# EAGLE design Ctrl_Enc20 (EAGLE 9.1.2)
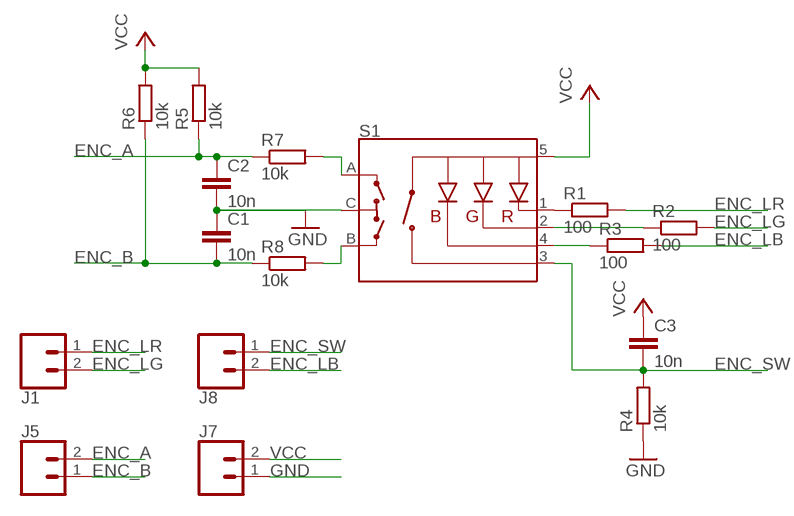
[diagram p0: schematic, sheet 1]

## Parts
C1  10n  C-EUC0603  [C0603]
C2  10n  C-EUC0603  [C0603]
C3  10n  C-EUC0603  [C0603]
J1  CONN_02  [1X02]
J5  CONN_02  [1X02]
J7  CONN_02  [1X02]
J8  CONN_02  [1X02]
R1  100  R-EU_R0603  [R0603]
R2  100  R-EU_R0603  [R0603]
R3  100  R-EU_R0603  [R0603]
R4  10k  R-EU_R0603  [R0603]
R5  10k  R-EU_R0603  [R0603]
R6  10k  R-EU_R0603  [R0603]
R7  10k  R-EU_R0603  [R0603]
R8  10k  R-EU_R0603  [R0603]
S1  ENCODER-RGB-SWITCH  [ENCODER_LED_3]

## Nets
ENC_A: C2.1 J5.2 R5.1 R7.1
ENC_B: C1.2 J5.1 R6.1 R8.1
ENC_LB: J8.2 R3.2
ENC_LG: J1.2 R2.2
ENC_LR: J1.1 R1.2
ENC_SW: C3.2 J8.1 R4.2 S1.3(SW)
GND: C1.1 C2.2 J7.1 R4.1 S1.C
N$1: R1.1 S1.1(-R)
N$2: R2.1 S1.2(-G)
N$3: R3.1 S1.4(-B)
N$4: R7.2 S1.A
N$5: R8.2 S1.B
VCC: C3.1 J7.2 R5.2 R6.2 S1.5(+)

## Library data of the parts
C1-C3 = rcl:C-EU: CAPACITOR, European symbol; SPICEPREFIX: C
J1 J5 J7 J8 = SparkFun-Connectors:CONN_02: Multi connection point. Often used as Generic Header-pin footprint for 0.1 inch spaced/style header connections On any of the 0.1 inch spaced packages, you can populate with these: Break Away Headers - Straight <https://www.sparkfun.com/products/116> (PRT-00116) Break Away Male Headers - Right Angle <https://www.sparkfun.com/products/553> (PRT-00553) Female Headers <https://www.sparkfun.com/products/115> (PRT-00115) Break Away Headers - Machine Pin <https://www.sparkfun.com/products/117> (PRT-00117) Break Away Female Headers - Swiss Machine Pin <https://www.sparkfun.com/products/743> (PRT-00743) For SCREWTERMINALS and SPRING TERMINALS visit here: Screw Terimnals on SparkFun.com <https://www.sparkfun.com/search/results?term=Screw+Terminals> (5mm/3.5mm/2.54mm spacing) This device is also useful as a general connection point to wire up your design to another part of your project. Our various solder wires solder well into these plated through hole pads. Hook-Up Wire - Assortment (Stranded, 22 AWG) <https://www.sparkfun.com/products/11375> (PRT-11375) Hook-Up Wire - Assortment (Solid Core, 22 AWG) <https://www.sparkfun.com/products/11367> (PRT-11367) View the entire wire category on our website here <https://www.sparkfun.com/categories/141> Special notes: Molex polarized connector foot print use with: PRT-08233 with associated crimp pins and housings. 2.54_SCREWTERM for use with PRT-10571. 3.5mm Screw Terminal footprints for PRT-08084 5mm Screw Terminal footprints for use with PRT-08432
R1-R8 = rcl:R-EU_: RESISTOR, European symbol; SPICEPREFIX: R
S1 = SparkFun-Switches:ENCODER-RGB-SWITCH: Illuminated Rotary Encoder w/ RGB LED and select switch Encoders rotate similarly to potentiometers, but they’re different from potentiometers in that an encoder has full rotation without limits. They output gray code so that you can tell how much and in which direction the encoder has been turned. This encoder includes an RGB LED and a push-down select switch. Part #: Top Up EC12PLRGBSDVBF-D <http://top-up.so-buy.com/front/bin/ptdetail.phtml?Part=EC12PLRGBSDVBF-D> SparkFun Products Rotary Encoder - Illuminated (RGB) <https://www.sparkfun.com/products/10982> (COM-10982); PROD_ID: RES-10859; SF_SKU: COM-10982

## Board
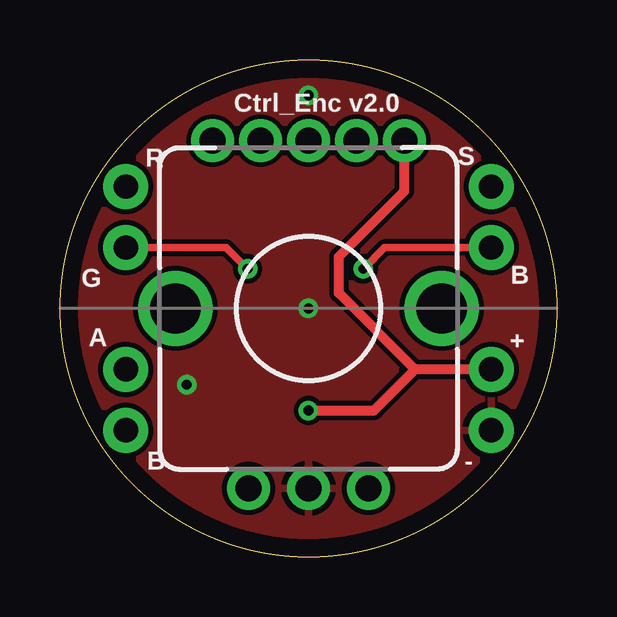
[diagram p1: board, top side]
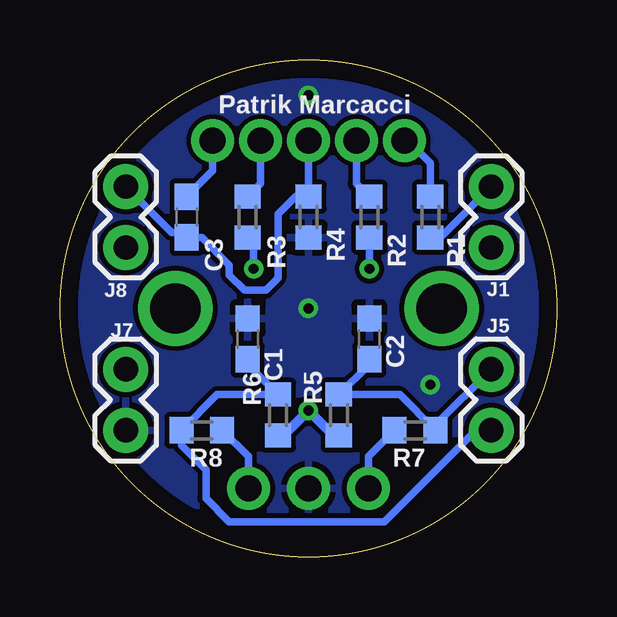
[diagram p2: board, bottom side, seen from below]

Size 20.73 x 20.73 mm. Coordinates in mm from the lower left corner, seen from the top.
Outline: circle at 10.36,10.36 radius 10.36
Copper layers (1*16): Top 0.035mm / dielectric 1.5mm / Bottom 0.035mm
Design rules "default *": minimum track width 8mil, minimum drill 16mil, track to track 8mil, track to pad 10mil, pad to pad 8mil, via to via 8mil, smd to smd 8mil, copper to edge 30mil, drill to drill 8mil, minimum pad ring 10mil, minimum via ring 8mil, stop-mask expansion 4mil, vias tented up to drill 16mil, thermal gap 10mil

### Footprints (pad centres in the part's own frame; a part is rotated, then mirrored left to right if it is on the bottom)
C0603 = smd 1.1 x 1: 1 -0.85,0; 2 0.85,0
1X02 = drill 1.016 pad 1.88: 1 0,0; 2 2.54,0
R0603 = smd 1 x 1.1: 1 -0.85,0; 2 0.85,0
ENCODER_LED_3 = drill 1.1 pad 1.778: 1 -4,7; 2 -2,7; 3 0,7; 4 2,7; 5 4,7 | drill 1.1 pad 1.8: A -2.5,-7.5; B 2.5,-7.5; C 0,-7.5 | drill 2.1: M1 -5.55,0; M2 5.55,0

### Placement (x,y rotation side)
C1  12.9,9.09 270 bottom
C2  7.82,9.09 90 bottom
C3  15.44,14.17 270 bottom
J1  2.74,15.44 270 bottom
J5  2.74,5.28 90 bottom
J7  17.98,5.28 90 bottom
J8  17.98,15.44 270 bottom
R1  5.28,14.17 270 bottom
R2  7.82,14.17 270 bottom
R3  12.9,14.17 270 bottom
R4  10.36,14.17 90 bottom
R5  9.09,5.92 270 bottom
R6  11.63,5.92 270 bottom
R7  5.92,5.28 180 bottom
R8  14.81,5.28 0 bottom
S1  10.36,10.36 0 top

### Tracks (layer width: path | path; a pad name or v marks a point on that pad's centre or on a via)
ENC_A
  Bottom 0.305: 5.07,5.5 J5.2 | 7.78,8.2 C2.1 | R7.1 6.55,6.77 R5.1 7.82,8.04
  Bottom 0.406: 7.82,8.04 C2.1 | R7.1 5.07,5.5
ENC_B
  Bottom 0.305: 15.66,4.65 15.55,4.54 | 15.55,4.54 14.64,3.63 14.64,2.45 13.67,1.47 7.19,1.47 3.38,5.28 J5.1 | C1.2 12.94,8.2 12.94,8.08 R6.1 14.17,6.77 R8.1 15.66,4.65 | 15.55,4.54 15.66,4.65
ENC_LB  (via drill 0.41)
  Top 0.305: J8.2 13.54,12.9 v12.65,12.01
  Bottom 0.305: v12.65,12.01 12.65,13.07 R3.2
ENC_LG  (via drill 0.41)
  Top 0.305: J1.2 6.93,12.9 v7.82,12.01
  Bottom 0.305: R2.2 v7.82,12.01
ENC_LR
  Bottom 0.305: R1.2 4.86,13.32 J1.1
ENC_SW
  Bottom 0.305: S1.3 R4.2 10.91,15.02 11.63,14.3 11.63,11.63 12.14,11.13 13.03,11.13 13.67,11.76 13.67,12.18 14.81,13.32 C3.2 15.66,13.54 16.08,13.54 J8.1
GND  (via drill 0.41)
  other vias: 5.28,7.19 10.36,19.25 10.36,10.36
  pour Top: -0.43,21.16 -0.43,-0.43 21.16,-0.43 21.16,21.16
  pour Bottom: -0.43,21.16 21.16,21.16 21.16,-0.43 -0.43,-0.43
N$1
  Bottom 0.305: S1.1 6.23,17.36 5.28,16.42 R1.1
N$2
  Bottom 0.305: S1.2 8.36,15.56 R2.1
N$3
  Bottom 0.305: S1.4 12.36,15.56 R3.1
N$4
  Bottom 0.305: R7.2 7.86,4.19 S1.A
N$5
  Bottom 0.305: S1.B 12.86,4.19 R8.2
VCC  (via drill 0.41)
  Top 0.406: S1.5 14.36,15.25 11.63,12.52 11.63,11 14.81,7.82 | J7.2 14.81,7.82 | v10.36,6.11 13.09,6.11 14.81,7.82
  Bottom 0.305: C3.1 14.36,16.1 S1.5
  Bottom 0.406: R6.2 11.4,5.07 v10.36,6.11 9.32,5.07 R5.2

### Text on the board
tNames: Ctrl_Enc v2.0 | R | S | G | B | A | + | B | -
bNames: Patrik Marcacci